# Altium schematic sheet EEPROM.SchDoc
size A4
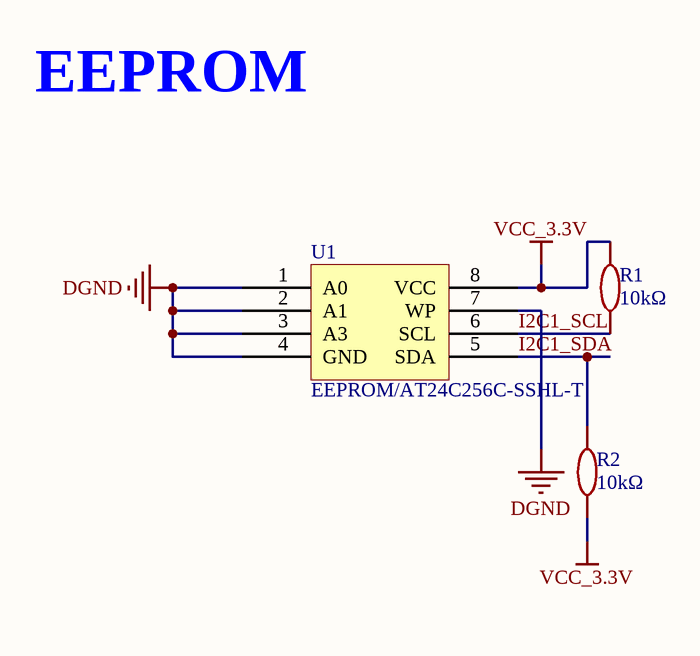
[diagram p0: EEPROM.SchDoc]

## Parts
R1  10kΩ  [R0402]
R2  10kΩ  [R0402]
U1  EEPROM/AT24C256C-SSHL-T  [SOIC-8_150mil]

## Nets
DGND: U1.1(A0) U1.2(A1) U1.3(A3) U1.4(GND) U1.7(WP)
VCC_3.3V: R1.2 R2.1 U1.8(VCC)
I2C1_SCL: R1.1 U1.6(SCL)
I2C1_SDA: R2.2 U1.5(SDA)

## Notes on the sheet
- EEPROM

## Library data of the parts
R1 R2 = 10kΩ,R0402: 电阻类型:厚膜电阻;阻值:10kΩ;精度:±1%;功率:100mW;最大工作电压:75V;温度系数:±100ppm/℃;
U1 = EEPROM/AT24C256C-SSHL-T_[C6482]: EEPROM; ComponentLink1Description: 供应商链接; ComponentLink1URL: http://www.szlcsc.com/product/details_6947.html